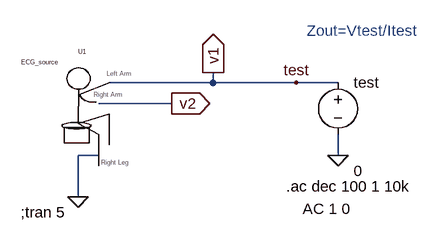
[diagram p0: schematic exp1.asc]
exp1.asc, the LTspice schematic file:
Version 4
SHEET 1 880 680
WIRE 336 112 336 96
WIRE 336 112 176 112
WIRE 464 112 336 112
WIRE 528 112 464 112
WIRE 272 144 160 144
WIRE 160 224 128 224
WIRE 528 224 528 192
WIRE 128 288 128 224
FLAG 128 288 0
FLAG 336 96 v1
IOPIN 336 96 Out
FLAG 272 144 v2
IOPIN 272 144 Out
FLAG 528 224 0
FLAG 464 112 test
SYMBOL human 128 160 R0
SYMATTR InstName U1
SYMBOL voltage 528 96 R0
WINDOW 3 24 152 Left 2
WINDOW 123 -54 210 Left 2
WINDOW 39 0 0 Left 0
SYMATTR InstName test
SYMATTR Value 0
SYMATTR Value2 AC 1 0
TEXT 40 312 Left 2 !;tran 5
TEXT 448 272 Left 2 !.ac dec 100 1 10k
TEXT 480 32 Left 2 ;Zout=Vtest/Itest

The netlist it stands for:
* exp1.asc
XU1 test v2 0 ECG_source  ; pins LA RA RL
V§test test 0 0 AC 1 0
;tran 5
.ac dec 100 1 10k
* Zout=Vtest/Itest
.lib human.sub
.backanno
.end